# Altium schematic sheet ap33772s.SchDoc
size A4; SheetNumber: 3; SheetTotal: 4
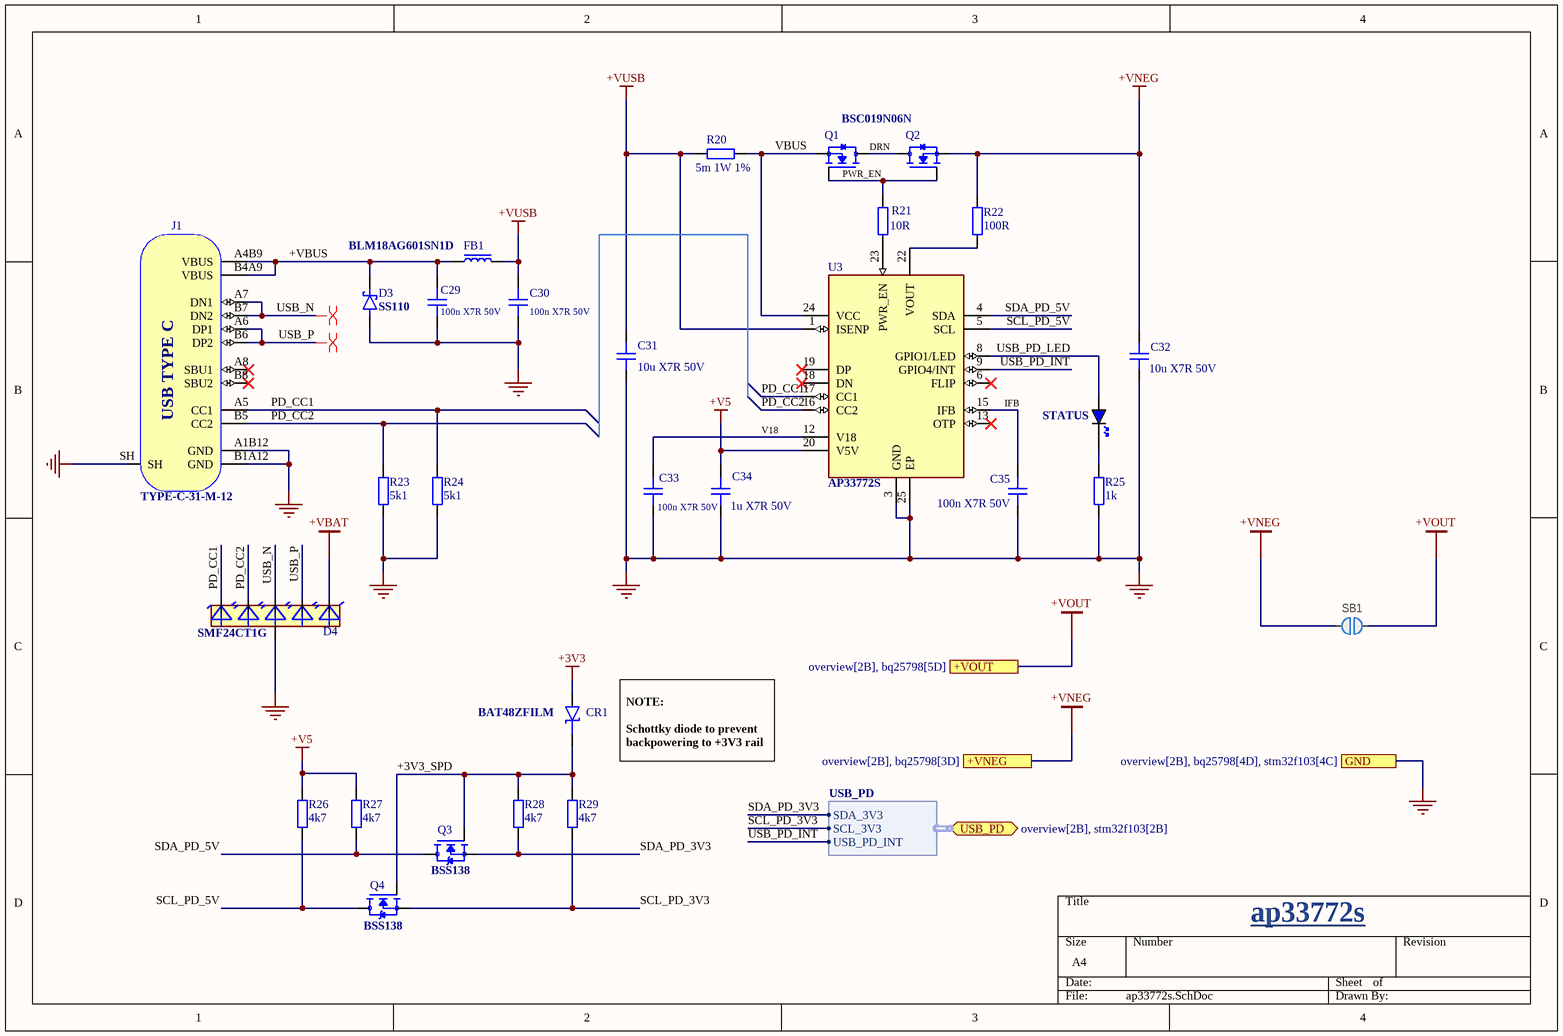
[diagram p0: ap33772s.SchDoc]

## Parts
C29  100n X7R 50V  [CAP_0603]
C30  100n X7R 50V  [CAP_0603]
C31  10u X7R 50V  [CAP_1210]
C32  10u X7R 50V  [CAP_1210]
C33  100n X7R 50V  [CAP_0603]
C34  1u X7R 50V  [CAP_0603]
C35  100n X7R 50V  [CAP_0603]
CR1  BAT48ZFILM  [*SOD-123_STM]
D3  SS110  [DIOM4325X250N]
D4  SMF24CT1G  [SOT65P210X110-6N]
FB1  BLM18AG601SN1D  [FB_0603]
J1  TYPE-C-31-M-12  [TYPE-C-31-M-12]
Q1  BSC019N06N  [BSC014N04LSIATMA1]
Q2  BSC019N06N  [BSC014N04LSIATMA1]  (value not drawn)
Q3  BSS138  [SOT95P240X111-3N]
Q4  BSS138  [SOT95P240X111-3N]
R20  5m 1W 1%  [RES_1206]
R21  10R  [RES_0603]
R22  100R  [RES_0603]
R23  5k1  [RES_0603]
R24  5k1  [RES_0603]
R25  1k  [RES_0603]
R26  4k7  [RES_0603]
R27  4k7  [RES_0603]
R28  4k7  [RES_0603]
R29  4k7  [RES_0603]
SB1  Solderbridge  [Solderbridge]  (value not drawn)  (no BOM)
STATUS  BLUE  [LED_0603_BLUE]  (value not drawn)
U3  AP33772S  [IC_AP33772S]

## Ports
+VNEG (see overview[2B], bq25798[3D]), +VOUT (see overview[2B], bq25798[5D]), GND (see overview[2B], bq25798[4D], stm32f103[4C]), USB_PD (bidir, harness USB_PD, see overview[2B], stm32f103[2B])

## Harnesses
USB_PD: SCL_3V3, SDA_3V3, USB_PD_INT

## Nets
+3V3: CR1.2
+V5: C34.2 R26.2 R27.2 U3.20(V5V)
+VBAT: D4.6(C5)
+VNEG: C32.2 Q2.1(S) R22.2 SB1.1 ; port +VNEG
+VOUT: SB1.2 ; port +VOUT
+VUSB: C30.1 C31.2 FB1.2 R20.1 U3.1(ISENP)
GND: C29.2 C30.2 C31.1 C32.1 C33.2 C34.1 C35.2 D3.A D4.2(A) J1.A1B12(GND) J1.B1A12(GND) J1.SH R23.1 R24.1 R25.2 U3.3(GND) U3.25(EP) ; port GND
+3V3_SPD: CR1.1 Q3.1(G) Q4.1(G) R28.2 R29.2
+VBUS: C29.1 D3.C(K) FB1.1 J1.A4B9(VBUS) J1.B4A9(VBUS)
DRN: Q1.5(D) Q2.5(D)
IFB: C35.1 U3.15(IFB)
PD_CC1: D4.1(C1) J1.A5(CC1) R24.2 U3.17(CC1)
PD_CC2: D4.3(C2) J1.B5(CC2) R23.2 U3.16(CC2)
PWR_EN: Q1.4(G) Q2.4(G) R21.2
SCL_PD_3V3: Q4.2(S) R29.1 ; port USB_PD.SCL_3V3
SCL_PD_5V: Q4.3(D) R26.1 U3.5(SCL)
SDA_PD_3V3: Q3.2(S) R28.1 ; port USB_PD.SDA_3V3
SDA_PD_5V: Q3.3(D) R27.1 U3.4(SDA)
USB_N: D4.4(C3) J1.A7(DN1) J1.B7(DN2)
USB_P: D4.5(C4) J1.A6(DP1) J1.B6(DP2)
USB_PD_INT: U3.9(GPIO4/INT) ; port USB_PD.USB_PD_INT
USB_PD_LED: STATUS.A U3.8(GPIO1/LED)
V18: C33.1 U3.12(V18)
VBUS: Q1.1(S) R20.2 U3.24(VCC)
NetR21_1: R21.1 U3.23(PWR_EN)
NetR22_1: R22.1 U3.22(VOUT)
NetR25_1: R25.1 STATUS.K

Not connected (* = marked no-connect by the designer): J1 A8(SBU1)* B8(SBU2)*; U3 6(FLIP)* 13(OTP)* 18(DN)* 19(DP)*

## Layout directives
differential pair: USB_N, USB_P

## Notes on the sheet
- NOTE:
  Schottky diode to prevent
  backpowering to +3V3 rail
- ap33772s
- (in symbol TYPE-C-31-M-12) USB TYPE C

## Library data of the parts
C29 C30 C33-C35 = CAP_0603: Capacitor SMD 0603; Manufacturer: *; Manufacturer Part Number: *; Distributor Link: *; LCSC: *; Rating: *; Dielectric: *
C31 C32 = CAP_1210: Capacitor SMD 1210; Manufacturer: *; Manufacturer Part Number: *; Distributor Link: *; LCSC: *; Rating: *; Dielectric: *
CR1 = BAT48ZFILM: Diode Schottky 40 V 350mA (DC) Surface Mount SOD-123; MF: STMicroelectronics; SnapEDA_Link: https://www.snapeda.com/parts/BAT48ZFILM/STMicroelectronics/view-part/?ref=snap; Package: SOD-123 STMicroelectronics; MP: BAT48ZFILM; Check_prices: https://www.snapeda.com/parts/BAT48ZFILM/STMicroelectronics/view-part/?ref=eda; Value: *
D3 = SS110: 1A, 100V, Schottky Rectifier; MF: Taiwan Semiconductor; SnapEDA_Link: https://www.snapeda.com/parts/SS110/taiwan/view-part/?ref=snap; Package: SMA-2 Taiwan Semiconductor; Value: *; MP: SS110; Check_prices: https://www.snapeda.com/parts/SS110/taiwan/view-part/?ref=eda
D4 = SMF24CT1G: Quint Uni-Directional TVS Diode, 100W, 6-Pin SC-88 | ON Semiconductor SMF24CT1G; MP: SMF05C; MF: ProTek Devices; Price: None; Availability: In Stock; Package: TSSOP-6 ProTek Devices; SnapEDA_Link: https://www.snapeda.com/parts/SMF05C/Protek+Devices/view-part/?ref=snap; Check_prices: https://www.snapeda.com/parts/SMF05C/Protek+Devices/view-part/?ref=eda; Value: *
FB1 = FB_0603: Ferrite Bead SMD 0603; Manufacturer: *; Manufacturer Part Number: *; Distributor Link: *; LCSC: *
J1 = TYPE-C-31-M-12: USB Type C Connector Horizontal SMT; Manufacturer: Koren Hroparts; Manufacturer Part Number: TYPE-C-31-M-12
Q1 Q2 = BSC019N06N: N-Channel 60 V 100A (Ta) 136W (Ta) Surface Mount PG-TDSON-8 FL; MF: Infineon; MP: IPD122N10N3 G; SnapEDA_Link: https://www.snapeda.com/parts/IPD122N10N3%20G/Infineon/view-part/?ref=snap; Package: TO-252-3 Infineon; Value: *; Check_prices: https://www.snapeda.com/parts/IPD122N10N3%20G/Infineon/view-part/?ref=eda
Q3 Q4 = BSS138: N-Channel 50 V 220mA (Ta) 350mW (Ta) Surface Mount SOT-23-3; MF: onsemi; SnapEDA_Link: https://www.snapeda.com/parts/BSS138/Onsemi/view-part/?ref=snap; Package: SOT-23-3 ON Semiconductor; Value: *; MP: BSS138; Check_prices: https://www.snapeda.com/parts/BSS138/Onsemi/view-part/?ref=eda
R20 = RES_1206: Resistor SMD 1206; Manufacturer: *; Manufacturer Part Number: *; Distributor Link: *; LCSC: *
R21-R29 = RES_0603: Resistor SMD 0603; Manufacturer: *; Manufacturer Part Number: *; Distributor Link: *; LCSC: *
SB1 = Solderbridge: Manufacturer: N.A.; Part number NEMS: 100500458; Pad Count: 2; Component Status: Active; System: Connector; Part Number: Solderbridge; Manufacturer Part Number: N.A.; LatestRevisionDate: 2009-12-14; Published: 2009-12-14; Value: Solderbridge; Note: N.A.; Artikkelnr Noca: N.A.; Footprint Doc: Solderbridge; Part number IPS: N.A.; ComponentLink1URL: N.A.; ComponentLink1Description: Datasheet; ComponentLink2URL: N.A.; ComponentLink2Description: Supplier link; HelpURL: N.A.; Supplier 1: N.A.; Supplier Part Number 1: N.A.; Supplier 2: N.A.; Supplier Part Number 2: N.A.; PartId: 100500458; Component Class: Connectors; Author: rsk; Part number Norautron: N.A.
STATUS = LED_0603_BLUE: LED 0603 BLUE SMD
U3 = AP33772S: USB Controller, PD Sink USB 3.0 USB Interface W-QFN4040-24 (Type A1); MF: Diodes Incorporated; MP: AP33771DKZ-13; Package: None; Price: None; Check_prices: https://www.snapeda.com/parts/AP33771DKZ-13/Diodes+Inc./view-part/?ref=eda; Value: *; SnapEDA_Link: https://www.snapeda.com/parts/AP33771DKZ-13/Diodes+Inc./view-part/?ref=snap; Availability: In Stock; Purchase-URL: https://pricing.snapeda.com/search?q=AP33771DKZ-13&ref=eda